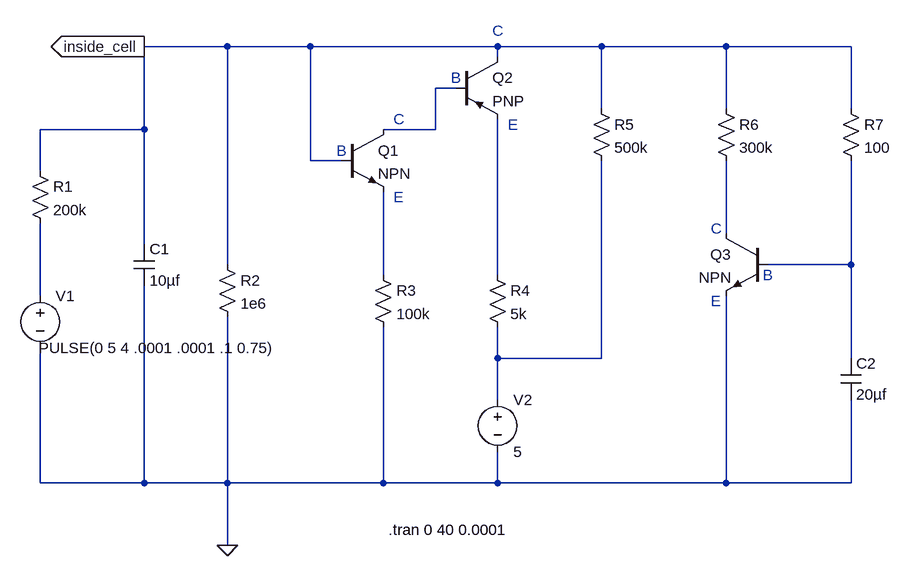
[diagram p0: schematic LIF_circuit.asc]
LIF_circuit.asc, the LTspice schematic file:
Version 4
SHEET 1 880 680
WIRE -864 -416 -992 -416
WIRE -736 -416 -864 -416
WIRE -448 -416 -736 -416
WIRE -288 -416 -448 -416
WIRE -96 -416 -288 -416
WIRE 96 -416 -96 -416
WIRE -448 -400 -448 -416
WIRE -512 -352 -544 -352
WIRE -288 -320 -288 -416
WIRE -96 -320 -96 -416
WIRE 96 -320 96 -416
WIRE -992 -288 -992 -416
WIRE -992 -288 -1152 -288
WIRE -544 -288 -544 -352
WIRE -544 -288 -624 -288
WIRE -736 -240 -736 -416
WIRE -688 -240 -736 -240
WIRE -1152 -224 -1152 -288
WIRE -96 -128 -96 -240
WIRE -992 -112 -992 -288
WIRE -864 -80 -864 -416
WIRE 96 -80 96 -240
WIRE 96 -80 -32 -80
WIRE -624 -64 -624 -192
WIRE -448 -64 -448 -304
WIRE -1152 -32 -1152 -144
WIRE -448 64 -448 16
WIRE -288 64 -288 -240
WIRE -288 64 -448 64
WIRE 96 64 96 -80
WIRE -448 128 -448 64
WIRE -1152 256 -1152 48
WIRE -992 256 -992 -48
WIRE -992 256 -1152 256
WIRE -864 256 -864 0
WIRE -864 256 -992 256
WIRE -624 256 -624 16
WIRE -624 256 -864 256
WIRE -448 256 -448 208
WIRE -448 256 -624 256
WIRE -96 256 -96 -32
WIRE -96 256 -448 256
WIRE 96 256 96 128
WIRE 96 256 -96 256
WIRE -864 352 -864 256
FLAG -864 352 0
FLAG -992 -416 inside_cell
IOPIN -992 -416 Out
SYMBOL res -1168 -240 R0
SYMATTR InstName R1
SYMATTR Value 200k
SYMBOL voltage -1152 -48 R0
WINDOW 3 362 96 Right 2
WINDOW 123 0 0 Left 0
WINDOW 39 0 0 Left 0
SYMATTR Value PULSE(0 5 4 .0001 .0001 .1 0.75)
SYMATTR InstName V1
SYMBOL cap -1008 -112 R0
SYMATTR InstName C1
SYMATTR Value 10µf
SYMBOL res -880 -96 R0
SYMATTR InstName R2
SYMATTR Value 1e6
SYMBOL npn -688 -288 R0
SYMATTR InstName Q1
SYMBOL res -640 -80 R0
SYMATTR InstName R3
SYMATTR Value 100k
SYMBOL pnp2 -512 -400 R0
SYMATTR InstName Q2
SYMBOL res -464 -80 R0
SYMATTR InstName R4
SYMATTR Value 5k
SYMBOL voltage -448 112 R0
SYMATTR InstName V2
SYMATTR Value 5
SYMBOL res -304 -336 R0
SYMATTR InstName R5
SYMATTR Value 500k
SYMBOL res -112 -336 R0
SYMATTR InstName R6
SYMATTR Value 300k
SYMBOL npn -32 -128 M0
SYMATTR InstName Q3
SYMBOL res 80 -336 R0
SYMATTR InstName R7
SYMATTR Value 100
SYMBOL cap 80 64 R0
SYMATTR InstName C2
SYMATTR Value 20µf
TEXT -616 328 Left 2 !.tran 0 40 0.0001
TEXT -520 -368 Left 2 ;B
TEXT -696 -256 Left 2 ;B
TEXT -608 -184 Left 2 ;E
TEXT -432 -296 Left 2 ;E
TEXT -608 -304 Left 2 ;C
TEXT -456 -440 Left 2 ;C
TEXT -40 -64 Left 2 ;B
TEXT -120 -24 Left 2 ;E
TEXT -120 -136 Left 2 ;C

The netlist it stands for:
* LIF_circuit.asc
R1 inside_cell N006 200k
V1 N006 0 PULSE(0 5 4 .0001 .0001 .1 0.75)
C1 inside_cell 0 10µf
R2 inside_cell 0 1e6
Q1 N001 inside_cell N004 0 NPN
R3 N004 0 100k
Q2 inside_cell N001 N005 0 PNP
R4 N005 N007 5k
V2 N007 0 5
R5 inside_cell N007 500k
R6 inside_cell N002 300k
Q3 N002 N003 0 0 NPN
R7 inside_cell N003 100
C2 N003 0 20µf
.model NPN NPN
.model PNP PNP
.lib standard.bjt
.tran 0 40 0.0001
* B
* B
* E
* E
* C
* C
* B
* E
* C
.backanno
.end